# EAGLE design CombinedSchem (EAGLE 9.6.2)
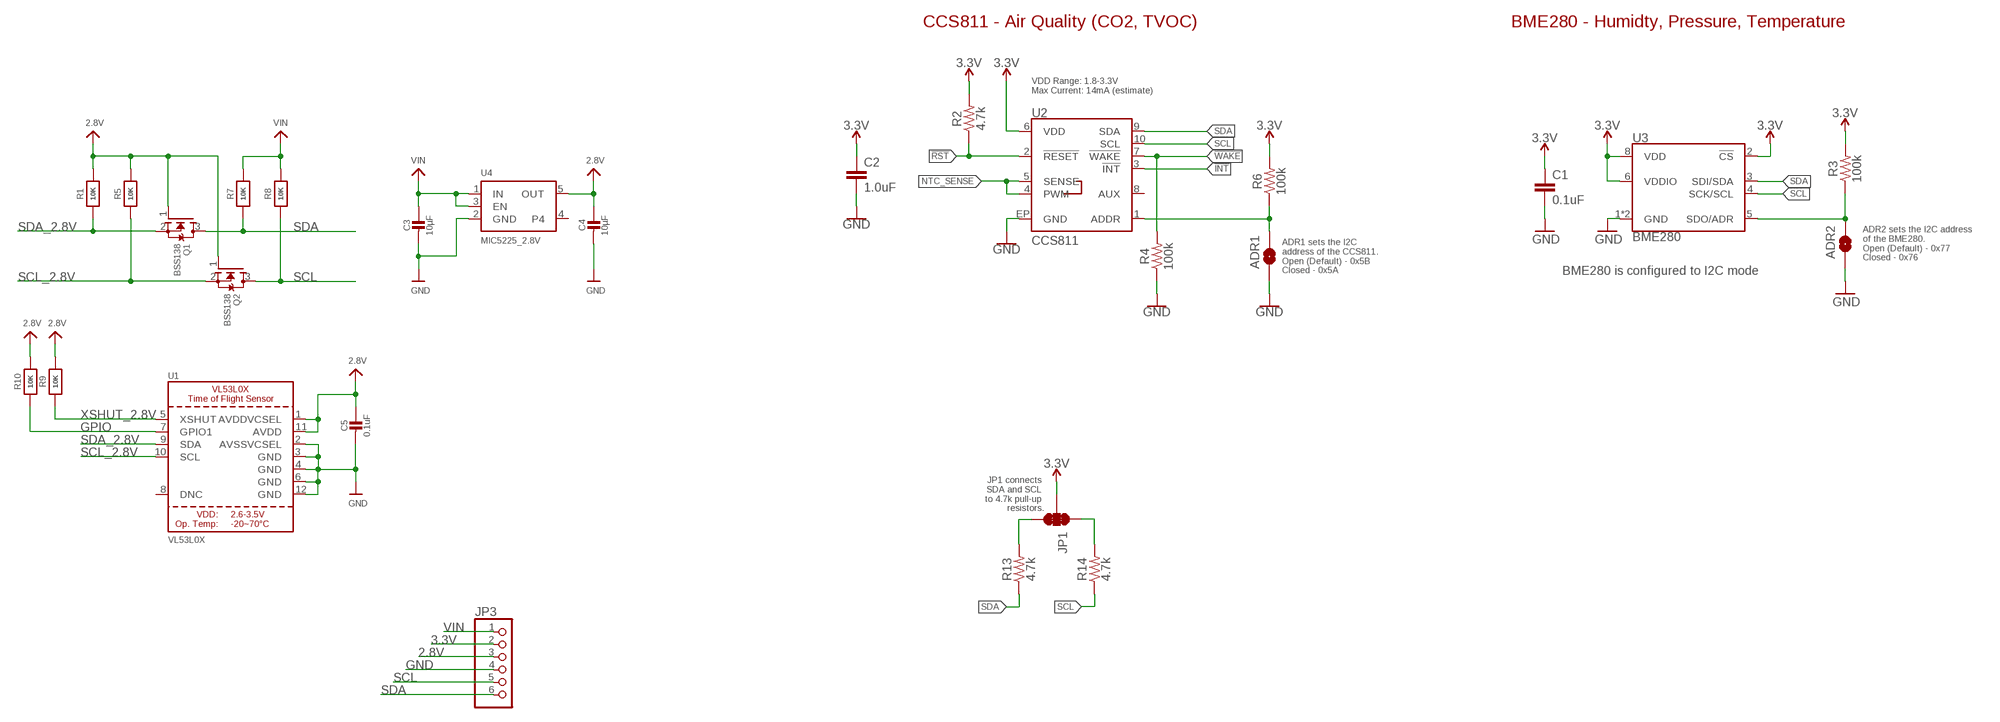
[diagram p0: schematic, sheet 1]

## Parts
ADR1  JUMPER-SMT_2_NO_SILK  [SMT-JUMPER_2_NO_SILK]
ADR2  JUMPER-SMT_2_NO_SILK  [SMT-JUMPER_2_NO_SILK]
C1  0.1uF  0.1UF-0603-25V-(+80/-20%)  [0603]
C2  1.0uF  1.0UF-0603-16V-10%  [0603]
C3  10µF  CAP_CERAMIC0805-NOOUTLINE  [0805-NO]
C4  10µF  CAP_CERAMIC0805-NOOUTLINE  [0805-NO]
C5  0.1uF  CAP_CERAMIC0805-NOOUTLINE  [0805-NO]
JP1  JUMPER-SMT_3_2-NC_TRACE_SILK  [SMT-JUMPER_3_2-NC_TRACE_SILK]
JP3  PINHD-1X6CLEAN  [1X06-CLEAN]
Q1  BSS138  MOSFET-NWIDE  [SOT23-WIDE]
Q2  BSS138  MOSFET-NWIDE  [SOT23-WIDE]
R1  10K  RESISTOR0805_NOOUTLINE  [0805-NO]
R2  4.7k  4.7KOHM-0603-1/10W-1%  [0603]
R3  100k  100KOHM-0603-1/10W-1%  [0603]
R4  100k  100KOHM-0603-1/10W-1%  [0603]
R5  10K  RESISTOR0805_NOOUTLINE  [0805-NO]
R6  100k  100KOHM-0603-1/10W-1%  [0603]
R7  10K  RESISTOR0805_NOOUTLINE  [0805-NO]
R8  10K  RESISTOR0805_NOOUTLINE  [0805-NO]
R9  10K  RESISTOR0805_NOOUTLINE  [0805-NO]
R10  10K  RESISTOR0805_NOOUTLINE  [0805-NO]
R13  4.7k  4.7KOHM-0603-1/10W-1%  [0603]
R14  4.7k  4.7KOHM-0603-1/10W-1%  [0603]
U1  VL53L0X  [LGA12_ST]
U2  CCS811  CCS811PRODUCTION  [LGA10]
U3  BME280  [LGA-8-2.5X2.5]
U4  MIC5225_2.8V  VREG_SOT23-5  [SOT23-5]

## Nets
2.8V: C4.1 C5.1 JP3.3 Q1.1(G) Q2.1(G) R1.2 R5.2 R9.2 R10.2 U1.1(AVDDVCSEL) U1.11(AVDD) U4.5(OUT)
3.3V: C1.1 C2.1 JP1.2 JP3.2 R2.2 R3.2 R6.2 U2.6(VDD) U3.2(!CS) U3.6(VDDIO) U3.8(VDD)
!INT: U2.3(!INT!)
!RST: R2.1 U2.2(!RESET!)
!WAKE: R4.2 U2.7(!WAKE!)
CCS811_ADDR: ADR1.2 R6.1 U2.1(ADDR)
GND: ADR1.1 ADR2.1 C1.2 C2.2 C3.2 C4.2 C5.2 JP3.4 R4.1 U1.2(AVSSVCSEL) U1.3(GND) U1.4(GND) U1.6(GND) U1.12(GND) U2.EP(GND) U3.1(GND) U3.7(GND) U4.2(GND)
GPIO: R10.1 U1.7(GPIO1)
N$4: JP1.3 R13.2
N$5: JP1.1 R14.2
NTC_SENSE: U2.4(PWM) U2.5(SENSE)
SCL: JP3.5 Q2.3(D) R8.1 R14.1 U2.10(SCL) U3.4(SCK/SCL)
SCL_2.8V: Q2.2(S) R5.1 U1.10(SCL)
SDA: JP3.6 Q1.3(D) R7.1 R13.1 U2.9(SDA) U3.3(SDI/SDA)
SDA_2.8V: Q1.2(S) R1.1 U1.9(SDA)
SDO/ADR: ADR2.2 R3.1 U3.5(SDO/ADR)
VIN: C3.1 JP3.1 R7.2 R8.2 U4.1(IN) U4.3(EN)
XSHUT_2.8V: R9.1 U1.5(XSHUT)
Unconnected: U1.8(DNC) U2.8(AUX) U4.4

## Notes on the sheet
- CCS811 - Air Quality (CO2, TVOC) | BME280 - Humidty, Pressure, Temperature
- VDD Range: 1.8-3.3V
  Max Current: 14mA (estimate)
- ADR2 sets the I2C address
  of the BME280.
  Open (Default) - 0x77
  Closed - 0x76
- ADR1 sets the I2C 
  address of the CCS811.
  Open (Default) - 0x5B
  Closed - 0x5A
- BME280 is configured to I2C mode
- JP1 connects 
  SDA and SCL 
  to 4.7k pull-up 
  resistors.

## Library data of the parts
ADR1 ADR2 = SparkFun-Jumpers:JUMPER-SMT_2_NO: Normally open jumper This jumper has two pads in close proximity to each other. Apply solder to close the connection. Round pads are easier to solder for beginners, but are a lot larger. SparkFun Product that uses the round pads: SparkFun EL Sequencer <https://www.sparkfun.com/products/12781>
C1 = SparkFun-Capacitors:0.1UF: 0.1µF ceramic capacitors A capacitor is a passive two-terminal electrical component used to store electrical energy temporarily in an electric field.; PROD_ID: CAP-00810
C2 = SparkFun-Capacitors:1.0UF: 1µF ceramic capacitors A capacitor is a passive two-terminal electrical component used to store electrical energy temporarily in an electric field.; PROD_ID: CAP-00868
C3-C5 = microbuilder:CAP_CERAMIC: Ceramic Capacitors For new designs, use the packages preceded by an '_' character since they are more reliable: The following footprints should be used on most boards: _0402 - Standard footprint for regular board layouts _0603 - Standard footprint for regular board layouts _0805 - Standard footprint for regular board layouts _1206 - Standard footprint for regular board layouts For extremely tight-pitch boards where space is at a premium, the following 'micro-pitch' footprints can be used (smaller pads, no silkscreen outline, etc.): _0402MP - Micro-pitch footprint for very dense/compact boards _0603MP - Micro-pitch footprint for very dense/compact boards _0805MP - Micro-pitch footprint for very dense/compact boards _1206MP - Micro-pitch footprint for very dense/compact boards
JP1 = SparkFun-Jumpers:JUMPER-SMT_3_2-NC_TRACE: Normally closed trace jumper (2 of 2 connections) This jumper has a trace between all three pads so they are normally closed (NC). Use a razor knife to open the connection(s). For best results follow the IPC guidelines for cutting traces: Cutout at least 0.063 mm (0.005 in). Remove all loose material to clean up the cut area. Seal the cut with an approved epoxy. Reapply solder to reclose the connection(s).
JP3 = adafruit:PINHD-1X6: PIN HEADER
Q1 Q2 = microbuilder:MOSFET-N: N-Channel Mosfet LEGEND VDS: Voltage Drain-Source ID: Drain Current RDS(ON): Drain-Source On-State Resistance VGS(TH): Gate-Source Threshold Voltage CISS: Drain-Source Input Capacitance SOT-23 Name VDS ID RDS(ON) VGS(TH) CISS Order Number 2N7002E 60V 260mA 2.5 Ohm 2.5V @ 250uA 26.7pF @ 25V 2N7002ET1GOSTR-ND BSH103 30V 850mA 400 mOhm 400mV @ 1mA 83pF @ 24V BSH103,235-ND BSS138 60V 320mA 1.6 Ohm 1.5V @ 250uA 50pF @ 10V Mouser: 771-BSS138PW115 DMN2075U-7 20V 4.2A 38 mOhm 1V @ 250 uA 594.3pF @ 10V DMN2075U-7DICT-ND * BSS138 good choice for I2C level-shifting POWERPAK 1212-8 Name VDS ID RDS(ON) VGS(TH) CISS Order Number Si7308DN 60V 6A 58 mOhm 3V @ 250uA 665pF @ 15V SI7308DN-T1-E3CT-ND
R1 R5 R7-R10 = microbuilder:RESISTOR: Resistors For new designs, use the packages preceded by an '_' character since they are more reliable: The following footprints should be used on most boards: _0402 - Standard footprint for regular board layouts _0603 - Standard footprint for regular board layouts _0805 - Standard footprint for regular board layouts _1206 - Standard footprint for regular board layouts For extremely tight-pitch boards where space is at a premium, the following 'micro-pitch' footprints can be used (smaller pads, no silkscreen outline, etc.): _0402MP - Micro-pitch footprint for very dense/compact boards _0603MP - Micro-pitch footprint for very dense/compact boards _0805MP - Micro-pitch footprint for very dense/compact boards _1206MP - Micro-pitch footprint for very dense/compact boards
R2 R13 R14 = SparkFun-Resistors:4.7KOHM: 4.7kΩ resistor A resistor is a passive two-terminal electrical component that implements electrical resistance as a circuit element. Resistors act to reduce current flow, and, at the same time, act to lower voltage levels within circuits. - Wikipedia; PROD_ID: RES-07857
R3 R4 R6 = SparkFun-Resistors:100KOHM: 100kΩ resistor A resistor is a passive two-terminal electrical component that implements electrical resistance as a circuit element. Resistors act to reduce current flow, and, at the same time, act to lower voltage levels within circuits. - Wikipedia; PROD_ID: RES-07828
U1 = microbuilder:VL53L0X: VL53L0X - Laser Time of Flight Sensor (2M range)
U2 = SparkFun-Sensors:CCS811: AMS CCS811 – I2C Digital Gas Sensor Ultra-Low Power Digital Gas Sensor for Monitoring Indoor Air Quality AMS Product Page <http://ams.com/eng/Products/Environmental-Sensors/Gas-Sensors/CCS811> SparkFun Products:; PROD_ID: IC-13607
U3 = SparkFun-Sensors:BME280: Bosch BME280 – Combined Humidity and Pressure Sensor The BME280 is as combined digital humidity, pressure and temperature sensor based on proven sensing principles. The sensor module is housed in an extremely compact metal-lid LGA package with a footprint of only 2.5×2.5mm² with a height of 0.93mm. Its small dimensions and its low power consumption allow the implementation in battery driven devices such as handsets, GPS modules or watches. Datasheet <https://cdn.sparkfun.com/assets/learn_tutorials/4/1/9/BST-BME280_DS001-10.pdf> SparkFun Products SparkFun Atmospheric Sensor Breakout - BME280 <https://www.sparkfun.com/products/13676> (SEN-13676); PROD_ID: IC-13090
U4 = microbuilder:VREG_SOT23-5: SOT23-5 Fixed Voltage Regulators Part Current Out V Out V In V Dropout θJA (°C/W) TJ (°C) Digikey Part No. ADP121 150mA 3.3V 3.4-5.5V 0.09V @ 150mA -- -- ADP121-AUJZ33R7CT-ND ADP121 150mA 3.0V 3.1-5.5V 0.09V @ 150mA -- -- ADP121-AUJZ30R7CT-ND ADP122 300mA 3.3V 3.4-5.5V 0.085V @ 300mA -- -- ADP122AUJZ-3.3-R7CT-ND ADP1712 300mA 3.3V 3.5-5.5V 0.17V @ 300mA -- -- ADP1712AUJZ-3.3-R7TR-ND AP7311 (Low Cost) 150mA 3.3V 3.5-6V 0.15V @ 150mA -- -- AP7311-33WG-7DICT-ND LD39015M18R 150mA 1.8V 1.9V-5.5V 0.08V @ 100mA -- -- 497-6977-1-ND LP2985A-33DBVR 150mA 3.3V 3.3-16V 0.28V @ 150mA 206 150 296-18479-1-ND MCP1824T-3302E/OT 300mA 3.3V 3.5V-6V 0.2V @ 300mA -- -- MCP1824T-3302E/OTCT-ND MIC5205-2.5YM5 TR 150mA 2.5V 2.7-16V 0.165V @ 150mA -- -- 576-1257-2-ND MIC5205-3.0YM5 TR 150mA 3.0V 3.2V-16V 0.165V @ 150mA -- -- 576-1258-2-ND MIC5205-3.3YM5 TR 150mA 3.3V 3.5V-16V 0.165V @ 150mA -- -- 576-1259-2-ND TPS780330220 150mA 3.3V+2.2V 3.6-5.5V 250mV Max -- -- 296-23332-1-ND TDA3663/N1,135 100mA 3.3V 3.5-45V 0.18V @ 50mA -- -- 568-5343-1-ND Max operating temp can be calculated using θJA, TJ (max junction temperature), and power in watts. Set the "Maximum Ambient Temperature" until it reaches TJ ("Max Junction Temperature"), which is the absolute limit for safe use of the regulator: Heat Sink Temperature Calculator <http://www.daycounter.com/Calculators/Heat-Sink-Temperature-Calculator.phtml> For example, With 12V source into a 3.3V LP2985 and a 30mA load, we are dissipating (12V-3.3V) * 0.03A = 0.261W. With a θJA of 206 °C/W, a TJ of 150°C, and 261mW we can safely use the chip without a heat sink up to 75°C (=147.1°C Junction Temperature).

## Board
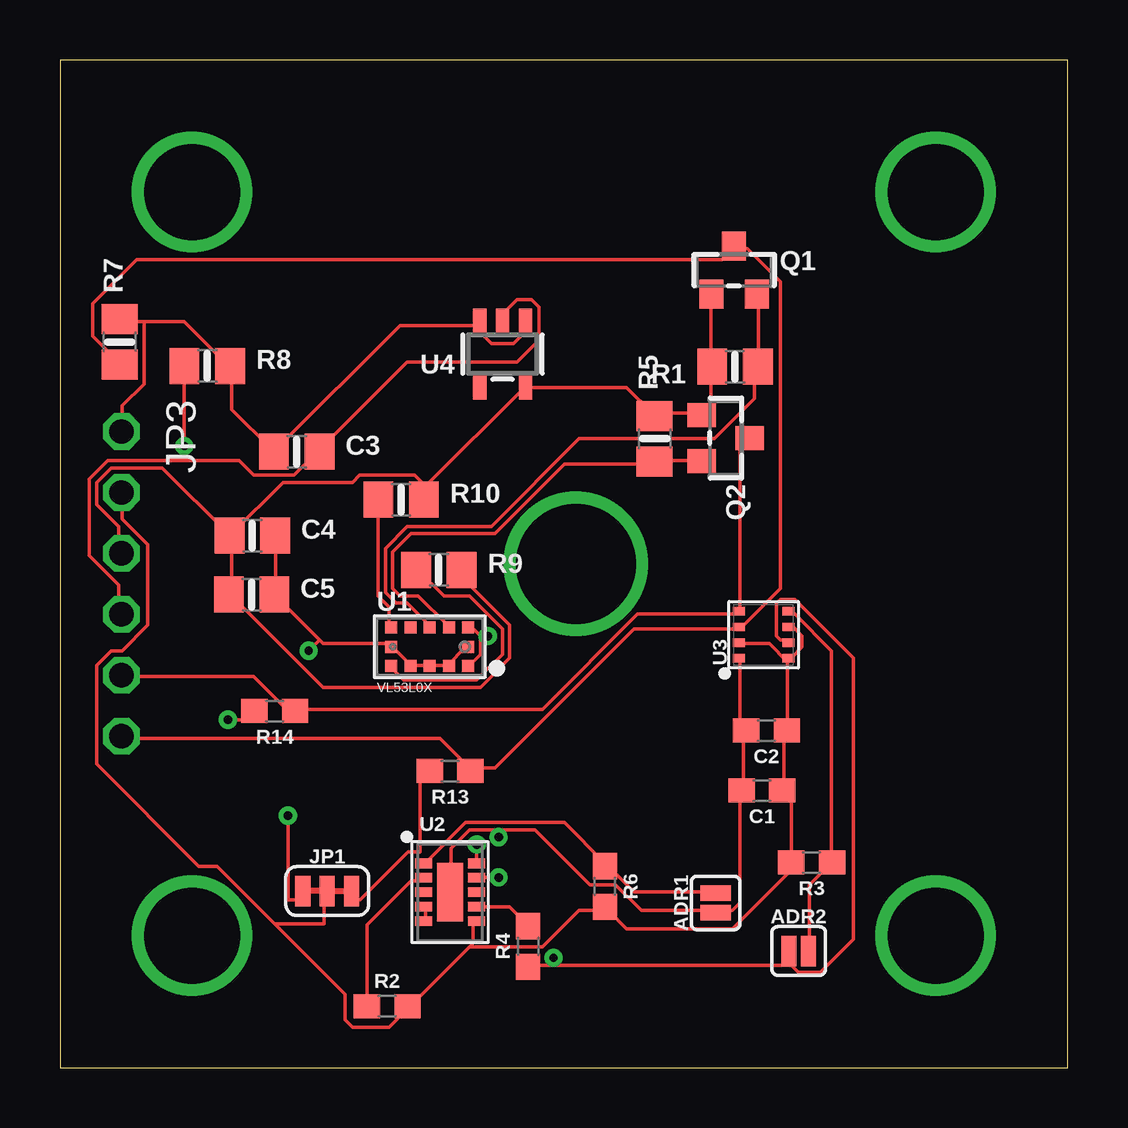
[diagram p1: board, top side]
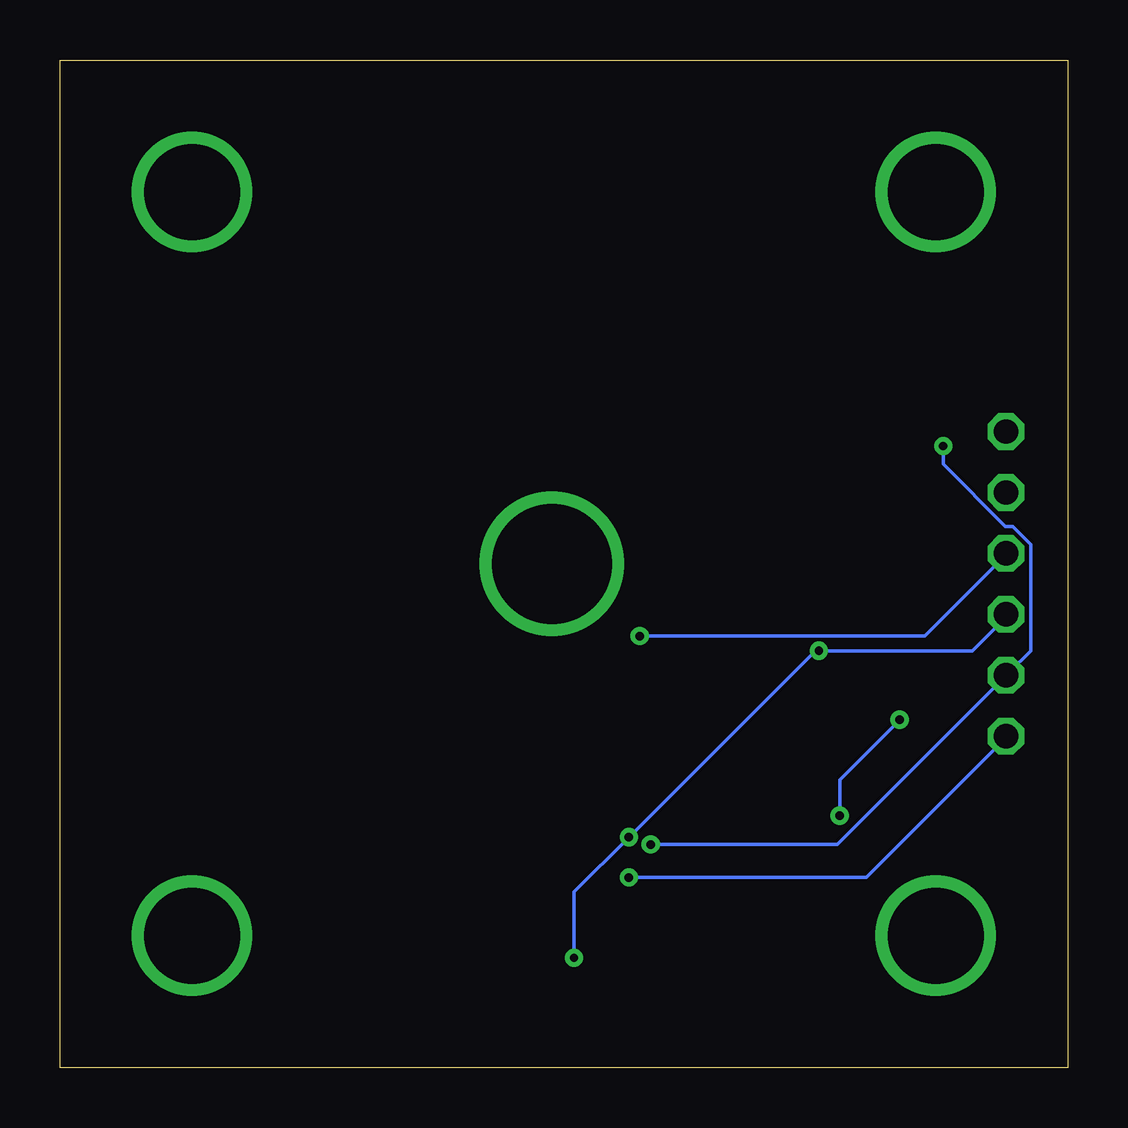
[diagram p2: board, bottom side, seen from below]

Size 42 x 42 mm. Coordinates in mm from the lower left corner, seen from the top.
Outline: 0,0 42,0 42,42 0,42 0,0
Copper layers (1*16): Top 0.035mm / dielectric 1.5mm / Bottom 0.035mm
Design rules "default": minimum track width 6mil, minimum drill 0.35mm, track to track 6mil, track to pad 6mil, pad to pad 6mil, via to via 6mil, smd to smd 6mil, copper to edge 40mil, drill to drill 6mil, minimum pad ring 10mil, minimum via ring 8mil, stop-mask expansion 4mil, vias tented up to drill 0mil, thermal gap 10mil

### Footprints (pad centres in the part's own frame; a part is rotated, then mirrored left to right if it is on the bottom)
SMT-JUMPER_2_NO_SILK = smd 0.635 x 1.27: 1 -0.406,0; 2 0.406,0
0603 = smd 1.1 x 1: 1 -0.85,0; 2 0.85,0
0805-NO = smd 1.24 x 1.5: 1 -0.95,0; 2 0.95,0
SMT-JUMPER_3_2-NC_TRACE_SILK = smd 0.635 x 1.27: 1 -1.016,0; 2 0,0; 3 1.016,0
1X06-CLEAN = drill 1.016 octagon: 1 -6.35,0; 2 -3.81,0; 3 -1.27,0; 4 1.27,0; 5 3.81,0; 6 6.35,0
SOT23-WIDE = smd 1 x 1.2: 1 -0.95,-1; 2 0.95,-1; 3 0,1
LGA12_ST = smd 0.5 x 0.5: 1 1.6,-0.8; 2 0.8,-0.8; 3 0,-0.8; 4 -0.8,-0.8; 5 -1.6,-0.8; 6 -1.6,0; 7 -1.6,0.8; 8 -0.8,0.8; 9 0,0.8; 10 0.8,0.8; 11 1.6,0.8; 12 1.6,0
LGA10 = smd 0.7 x 0.4: 1 -1.1,1.2; 2 -1.1,0.6; 3 -1.1,0; 4 -1.1,-0.6; 5 -1.1,-1.2; 6 1.1,-1.2; 7 1.1,-0.6; 8 1.1,0; 9 1.1,0.6; 10 1.1,1.2 | smd 1.1 x 2.45: EP 0,0
LGA-8-2.5X2.5 = smd 0.35 x 0.5: 1 -0.975,1.025; 2 -0.325,1.025; 3 0.325,1.025; 4 0.975,1.025; 5 0.975,-1.025; 6 0.325,-1.025; 7 -0.325,-1.025; 8 -0.975,-1.025
SOT23-5 = smd 0.55 x 1.2: 1 -0.95,-1.3; 2 0,-1.3; 3 0.95,-1.3; 4 0.95,1.3; 5 -0.95,1.3

### Placement (x,y rotation side)
ADR1  27.33,6.86 90 top
ADR2  30.79,4.86 0 top
C1  29.26,11.55 180 top
C2  29.45,14.05 180 top
C3  9.87,25.67 0 top
C4  8.02,22.17 0 top
C5  7.99,19.71 0 top
JP1  11.14,7.36 0 top
JP3  2.57,20.16 270 top
Q1  28.1,33.24 0 top
Q2  27.75,26.24 270 top
R1  28.14,29.21 180 top
R2  13.64,2.55 0 top
R3  31.33,8.55 180 top
R4  19.52,5.05 90 top
R5  24.79,26.21 90 top
R6  22.71,7.55 270 top
R7  2.49,30.25 90 top
R8  6.14,29.25 0 top
R9  15.79,20.75 0 top
R10  14.22,23.67 0 top
R13  16.26,12.36 180 top
R14  8.95,14.86 180 top
U1  15.41,17.54 0 top
U2  16.26,7.31 0 top
U3  29.33,18.04 90 top
U4  18.45,29.74 180 top

### Tracks (layer width: path | path; a pad name or v marks a point on that pad's centre or on a via)
2.8V  (via drill 0.35)
  Top 0.152: 17.53,17.98 17.53,17.22 17.07,16.76 U1.1 | 17.53,17.98 17.07,18.44 U1.11 | v17.83,17.98 17.53,17.98 | C4.1 7.16,22.1 7.16,19.81 C5.1 7.16,19.66 10.97,15.85 17.53,15.85 18.75,17.07 18.75,18.44 16.76,20.42 16.76,20.73 R9.2 | Q1.1 27.13,32.16 27.13,29.26 R1.2 27.13,29.11 27.13,27.58 26.82,27.28 Q2.1 26.67,27.28 24.84,27.28 R5.2 24.69,27.28 23.62,28.35 19.51,28.35 U4.5 19.36,28.35 15.24,24.23 | 15.24,24.23 15.24,23.77 R10.2 15.24,24.23 | 15.24,24.23 14.78,24.69 12.5,24.69 12.19,24.38 9.3,24.38 7.16,22.25 C4.1 | JP3.3 2.44,21.49 2.44,22.55 1.52,23.47 1.52,24.38 2.13,24.99 4.27,24.99 7.01,22.25 C4.1
  Bottom 0.152: v17.83,17.98 5.94,17.98 2.59,21.34 JP3.3
3.3V
  Top 0.152: U3.6 30.48,18.44 30.94,17.98 30.94,17.53 30.48,17.07 U3.8 30.33,16.92 | 30.33,16.92 29.57,17.68 28.35,17.68 U3.2 | 30.33,16.92 30.33,14.17 C2.1 30.18,14.02 30.18,11.58 C1.1 30.18,11.43 30.48,11.12 R3.2 30.48,8.23 28.04,5.79 23.62,5.79 22.86,6.55 R6.2 22.71,6.55 21.64,6.55 20.12,5.03 17.07,5.03 | 17.07,5.03 14.63,2.59 R2.2 14.48,2.44 13.72,1.68 12.19,1.68 11.89,1.98 11.89,3.05 8.97,5.97 | 17.07,5.03 17.22,5.18 17.22,6.1 U2.6 | 8.97,5.97 6.55,8.38 5.79,8.38 1.52,12.65 1.52,16.76 2.13,17.37 2.59,17.37 3.66,18.44 3.66,21.79 2.59,22.86 2.59,23.93 JP3.2 | JP1.2 11,7 11,6 9,6 8.97,5.97
!RST
  Top 0.152: U2.2 15.09,7.77 14.63,7.77 12.8,5.94 12.8,2.59 R2.1
!WAKE
  Top 0.152: U2.7 17.37,6.71 18.75,6.71 19.51,5.94 R4.2
CCS811_ADDR
  Top 0.152: U2.1 15.24,8.53 16.92,10.21 21.03,10.21 22.71,8.53 R6.1 22.86,8.38 23.93,7.32 27.28,7.32 ADR1.2
GND  (via drill 0.35)
  Top 0.152: 30.48,4.27 30.79,3.96 31.7,3.96 33.07,5.33 33.07,17.07 30.63,19.51 30.02,19.51 29.87,19.36 29.87,17.98 30.02,17.83 30.33,17.83 U3.7 | 30.48,4.27 30.48,4.72 ADR2.1 30.48,4.27 | 30.48,4.27 20.57,4.27 | 20.57,4.27 19.66,4.27 R4.1 | U3.1 28.35,16.92 28.35,14.33 28.5,14.17 C2.2 28.5,14.02 28.5,11.58 C1.2 28.35,11.43 28.35,6.86 28.04,6.55 27.43,6.55 ADR1.1 27.28,6.55 24.23,6.55 23.16,7.62 22.1,7.62 19.81,9.91 18.29,9.91 | 18.29,9.91 17.07,9.91 16.31,9.14 16.31,7.32 U2.EP | 14.63,16.76 15.39,16.76 U1.3 15.54,16.76 16.15,16.76 | 14.63,16.76 13.87,17.53 U1.6 13.72,17.68 10.97,17.68 10.82,17.83 | 14.63,16.76 U1.4 | 16.15,16.76 16.92,17.53 U1.12 | 16.15,16.76 U1.2 | C4.2 8.99,22.1 8.99,19.81 C5.2 8.99,19.66 10.82,17.83 | U4.2 18.59,31.09 18.59,31.55 19.05,32 19.66,32 19.96,31.7 19.96,30.33 19.05,29.41 14.48,29.41 10.82,25.76 C3.2 10.67,25.6 9.75,24.69 8.08,24.69 7.47,25.3 1.98,25.3 1.22,24.54 1.22,21.34 2.44,20.12 2.44,18.9 JP3.4 | v10.36,17.37 10.82,17.83 | v18.29,9.6 18.29,9.91 | v20.57,4.57 20.57,4.27
  Bottom 0.152: JP3.4 2.59,18.75 3.96,17.37 v10.36,17.37 10.52,17.37 v18.29,9.6 20.57,7.32 v20.57,4.57
GPIO
  Top 0.152: U1.7 13.72,18.44 13.72,19.2 13.26,19.66 13.26,23.62 R10.1
N$1  (via drill 4 pad 4.5)
  other vias: 36.5,5.5
N$2  (via drill 4 pad 4.5)
  other vias: 5.5,5.5
N$3  (via drill 4 pad 4.5)
  other vias: 36.5,36.5
N$4
  Top 0.152: R13.2 15,12 15,9 14.5,9 12.5,7 12,7 JP1.3
N$5  (via drill 0.35)
  Top 0.152: v7,14.5 8,14.5 R14.2 | v9.5,10.5 9.5,7 10,7 JP1.1
  Bottom 0.152: v7,14.5 9.5,12 v9.5,10.5
N$6  (via drill 4 pad 4.5)
  other vias: 5.5,36.5
N$9  (via drill 5 pad 5.5)
  other vias: 21.5,21
NTC_SENSE
  Top 0.152: U2.5 15.24,6.25 15.24,6.71 U2.4
SCL  (via drill 0.35)
  Top 0.152: Q2.3 28.65,26.21 28.35,25.91 28.35,19.05 U3.4 28.19,18.9 24.08,18.9 20.12,14.94 9.91,14.94 R14.1 9.75,14.94 9.45,14.94 8.08,16.31 2.59,16.31 JP3.5 | v17.37,9.3 17.37,8.53 U2.10 | v5.18,25.91 5.18,29.11 R8.1
  Bottom 0.152: v17.37,9.3 9.6,9.3 2.59,16.31 JP3.5 2.44,16.46 1.52,17.37 1.52,21.79 2.29,22.55 2.59,22.55 5.18,25.15 v5.18,25.91
SCL_2.8V
  Top 0.152: U1.10 16.15,18.44 14.94,19.66 14.17,19.66 13.87,19.96 13.87,21.49 14.63,22.25 18.14,22.25 21.03,25.15 24.69,25.15 R5.1 24.84,25.3 26.67,25.3 Q2.2
SDA  (via drill 0.35)
  Top 0.152: v18.29,7.92 17.37,7.92 U2.9 | R7.1 2.44,29.41 1.37,30.48 1.37,31.85 3.2,33.68 27.58,33.68 28.04,34.14 Q1.3 28.19,34.14 28.65,34.14 30.02,32.77 30.02,19.96 28.35,18.29 U3.3 28.19,18.29 23.93,18.29 18.14,12.5 17.22,12.5 R13.1 17.07,12.5 15.85,13.72 2.59,13.72 JP3.6
  Bottom 0.152: v18.29,7.92 8.38,7.92 2.59,13.72 JP3.6
SDA_2.8V
  Top 0.152: U1.9 15.39,18.44 14.48,19.36 14.02,19.36 13.56,19.81 13.56,21.64 14.48,22.55 17.98,22.55 21.64,26.21 27.28,26.21 28.96,27.89 28.96,29.11 R1.1 29.11,29.26 29.11,32.16 Q1.2
SDO/ADR
  Top 0.152: U3.5 30.48,18.9 30.63,18.9 32.16,17.37 32.16,8.69 R3.1 32.16,8.53 31.24,7.62 31.24,4.88 ADR2.2
VIN
  Top 0.152: U4.1 19.36,30.94 19.36,30.63 18.9,30.18 17.98,30.18 17.53,30.63 17.53,30.94 U4.3 17.37,30.94 14.17,30.94 8.99,25.76 C3.1 8.84,25.76 7.16,27.43 7.16,29.11 R8.2 7.01,29.26 5.18,31.09 3.5,31.09 | 3.5,31.09 2.59,31.09 R7.2 | 3.5,31.09 3.5,28.5 2.59,27.58 2.59,26.52 JP3.1
XSHUT_2.8V
  Top 0.152: U1.5 13.87,16.61 14.33,16.15 17.37,16.15 18.44,17.22 18.44,18.29 17.07,19.66 16,19.66 14.94,20.73 R9.1